# EAGLE design untitled (EAGLE 7.5.0)
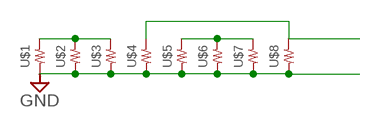
[diagram p0: schematic, sheet 1]

## Parts
U$1  RESISTOR__SMD  [1608]
U$2  RESISTOR__SMD  [1608]
U$3  RESISTOR__SMD  [1608]
U$4  RESISTOR__SMD  [1608]
U$5  RESISTOR__SMD  [1608]
U$6  RESISTOR__SMD  [1608]
U$7  RESISTOR__SMD  [1608]
U$8  RESISTOR__SMD  [1608]

## Nets
GND: U$1.1 U$2.1 U$3.1 U$4.1 U$5.1 U$6.1 U$7.1 U$8.1
N$2: U$1.2 U$2.2 U$3.2
N$3: U$5.2 U$6.2 U$7.2
N$5: U$4.2 U$8.2

## Library data of the parts
U$1-U$8 = 01_R:RESISTOR__SMD

## Board
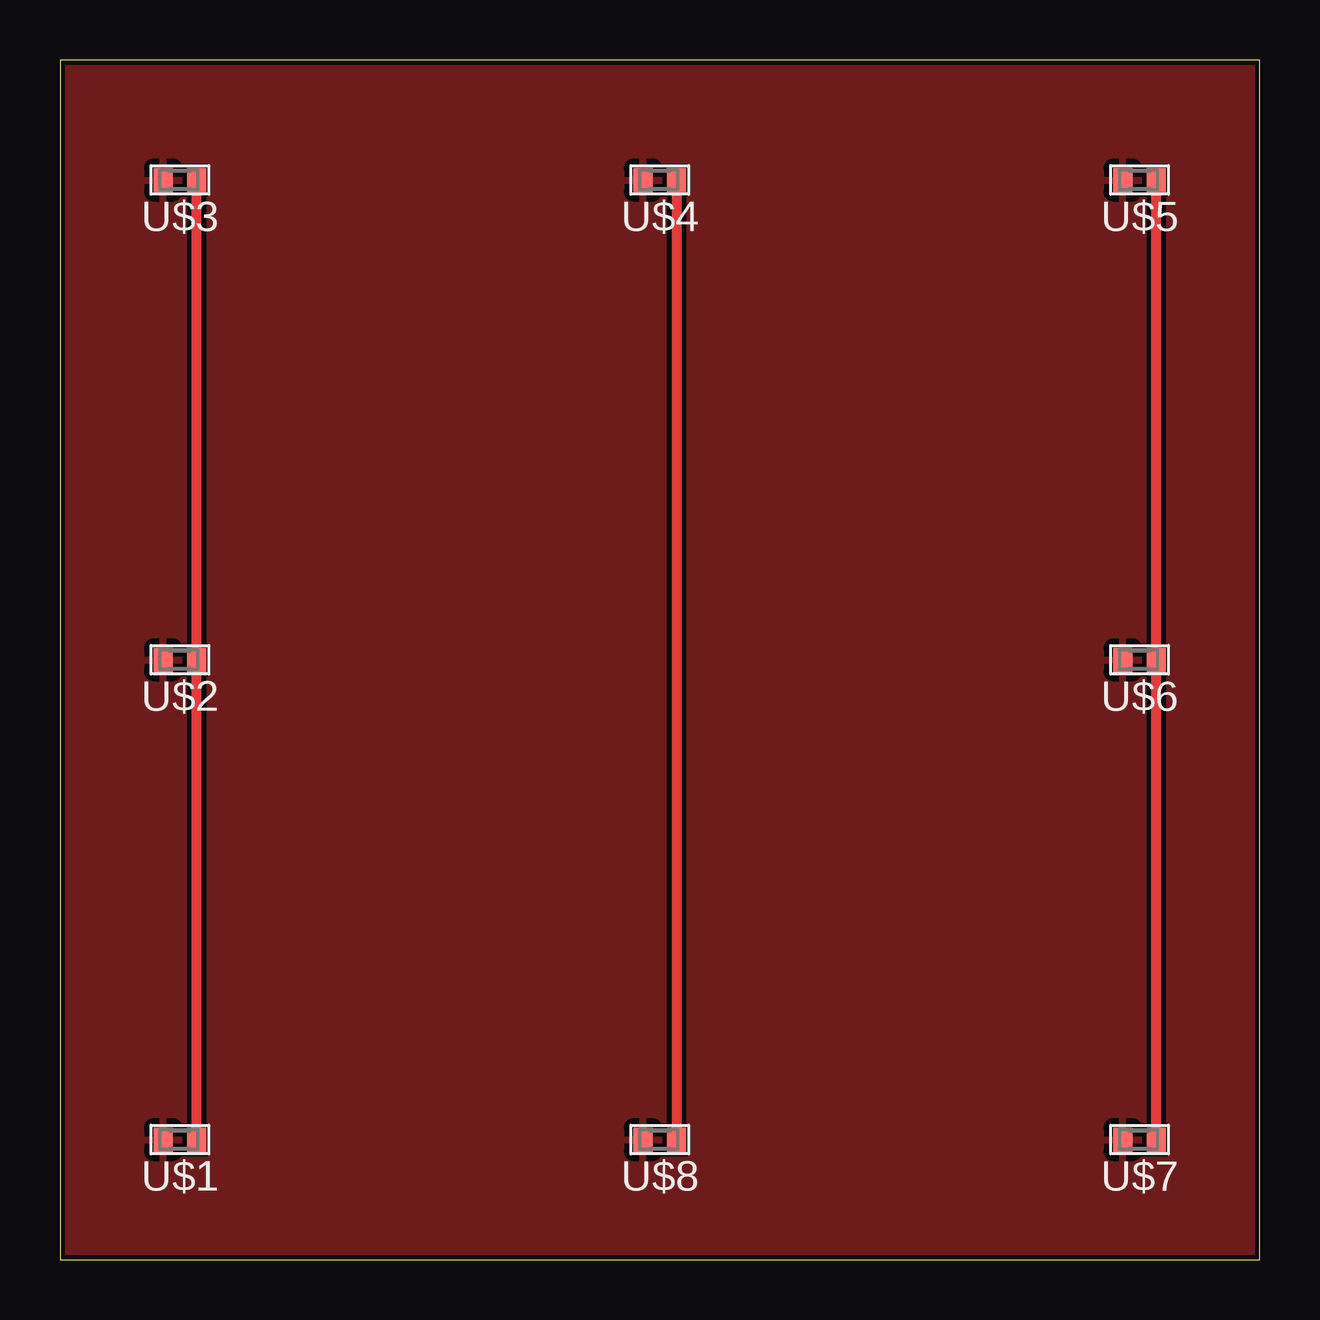
[diagram p1: board, top side]

Size 50 x 50 mm. Coordinates in mm from the lower left corner, seen from the top.
Outline: 0,0 50,0 50,50 0,50 0,0
Copper layers (1*16): Top 0.035mm / dielectric 1.5mm / Bottom 0.035mm
Design rules "default *": minimum track width 10mil, minimum drill 24mil, track to track 0.2mm, track to pad 8mil, pad to pad 8mil, via to via 8mil, smd to smd 8mil, copper to edge 0.2mm, drill to drill 8mil, minimum pad ring 10mil, minimum via ring 8mil, stop-mask expansion 4mil, vias tented up to drill 0mil, thermal gap 0.4mm

### Footprints (pad centres in the part's own frame; a part is rotated, then mirrored left to right if it is on the bottom)
1608 = smd 0.8 x 1: 1 -0.7,0; 2 0.7,0

### Placement (x,y rotation side)
U$1  5,5 0 top
U$2  5,25 0 top
U$3  5,45 0 top
U$4  25,45 0 top
U$5  45,45 0 top
U$6  45,25 0 top
U$7  45,5 0 top
U$8  25,5 0 top

### Tracks (layer width: path | path; a pad name or v marks a point on that pad's centre or on a via)
GND
  pour Top (rank 2): 0,50 50,50 50,0 0,0
N$2
  Top 0.406: U$1.2 U$2.2 U$3.2
N$3
  Top 0.406: U$7.2 U$6.2 U$5.2
N$5
  Top 0.406: U$4.2 U$8.2